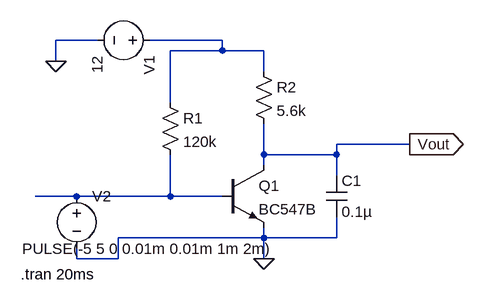
[diagram p0: schematic simpleSweep.asc]
simpleSweep.asc, the LTspice schematic file:
Version 4
SHEET 1 880 680
WIRE -48 0 -112 0
WIRE 144 0 32 0
WIRE 144 16 144 0
WIRE 144 16 64 16
WIRE 208 16 144 16
WIRE -112 32 -112 0
WIRE 208 48 208 16
WIRE 64 96 64 16
WIRE 432 160 320 160
WIRE 208 176 208 128
WIRE 320 176 320 160
WIRE 320 176 208 176
WIRE 208 192 208 176
WIRE 320 208 320 176
WIRE -80 240 -144 240
WIRE 64 240 64 176
WIRE 64 240 -80 240
WIRE 144 240 64 240
WIRE 208 304 208 288
WIRE 208 304 -16 304
WIRE 320 304 320 272
WIRE 320 304 208 304
WIRE -80 336 -80 320
WIRE -16 336 -16 304
WIRE -16 336 -80 336
WIRE 208 336 208 304
FLAG 208 336 0
FLAG 432 160 Vout
IOPIN 432 160 Out
FLAG -112 32 0
SYMBOL res 48 80 R0
SYMATTR InstName R1
SYMATTR Value 120k
SYMBOL res 192 32 R0
SYMATTR InstName R2
SYMATTR Value 5.6k
SYMBOL npn 144 192 R0
SYMATTR InstName Q1
SYMATTR Value BC547B
SYMBOL cap 304 208 R0
SYMATTR InstName C1
SYMATTR Value 0.1µ
SYMBOL voltage 48 0 R90
WINDOW 123 0 0 Left 0
WINDOW 39 0 0 Left 0
SYMATTR InstName V1
SYMATTR Value 12
SYMBOL voltage -80 224 R0
WINDOW 3 -84 97 Left 2
WINDOW 123 0 0 Left 0
WINDOW 39 0 0 Left 0
SYMATTR InstName V2
SYMATTR Value PULSE(-5 5 0 0.01m 0.01m 1m 2m)
TEXT -166 360 Left 2 !.tran 20ms

The netlist it stands for:
* simpleSweep.asc
R1 N001 N002 120k
R2 N001 Vout 5.6k
Q1 Vout N002 0 0 BC547B
C1 Vout 0 0.1µ
V1 N001 0 12
V2 N002 0 PULSE(-5 5 0 0.01m 0.01m 1m 2m)
.model NPN NPN
.model PNP PNP
.lib standard.bjt
.tran 20ms
.backanno
.end